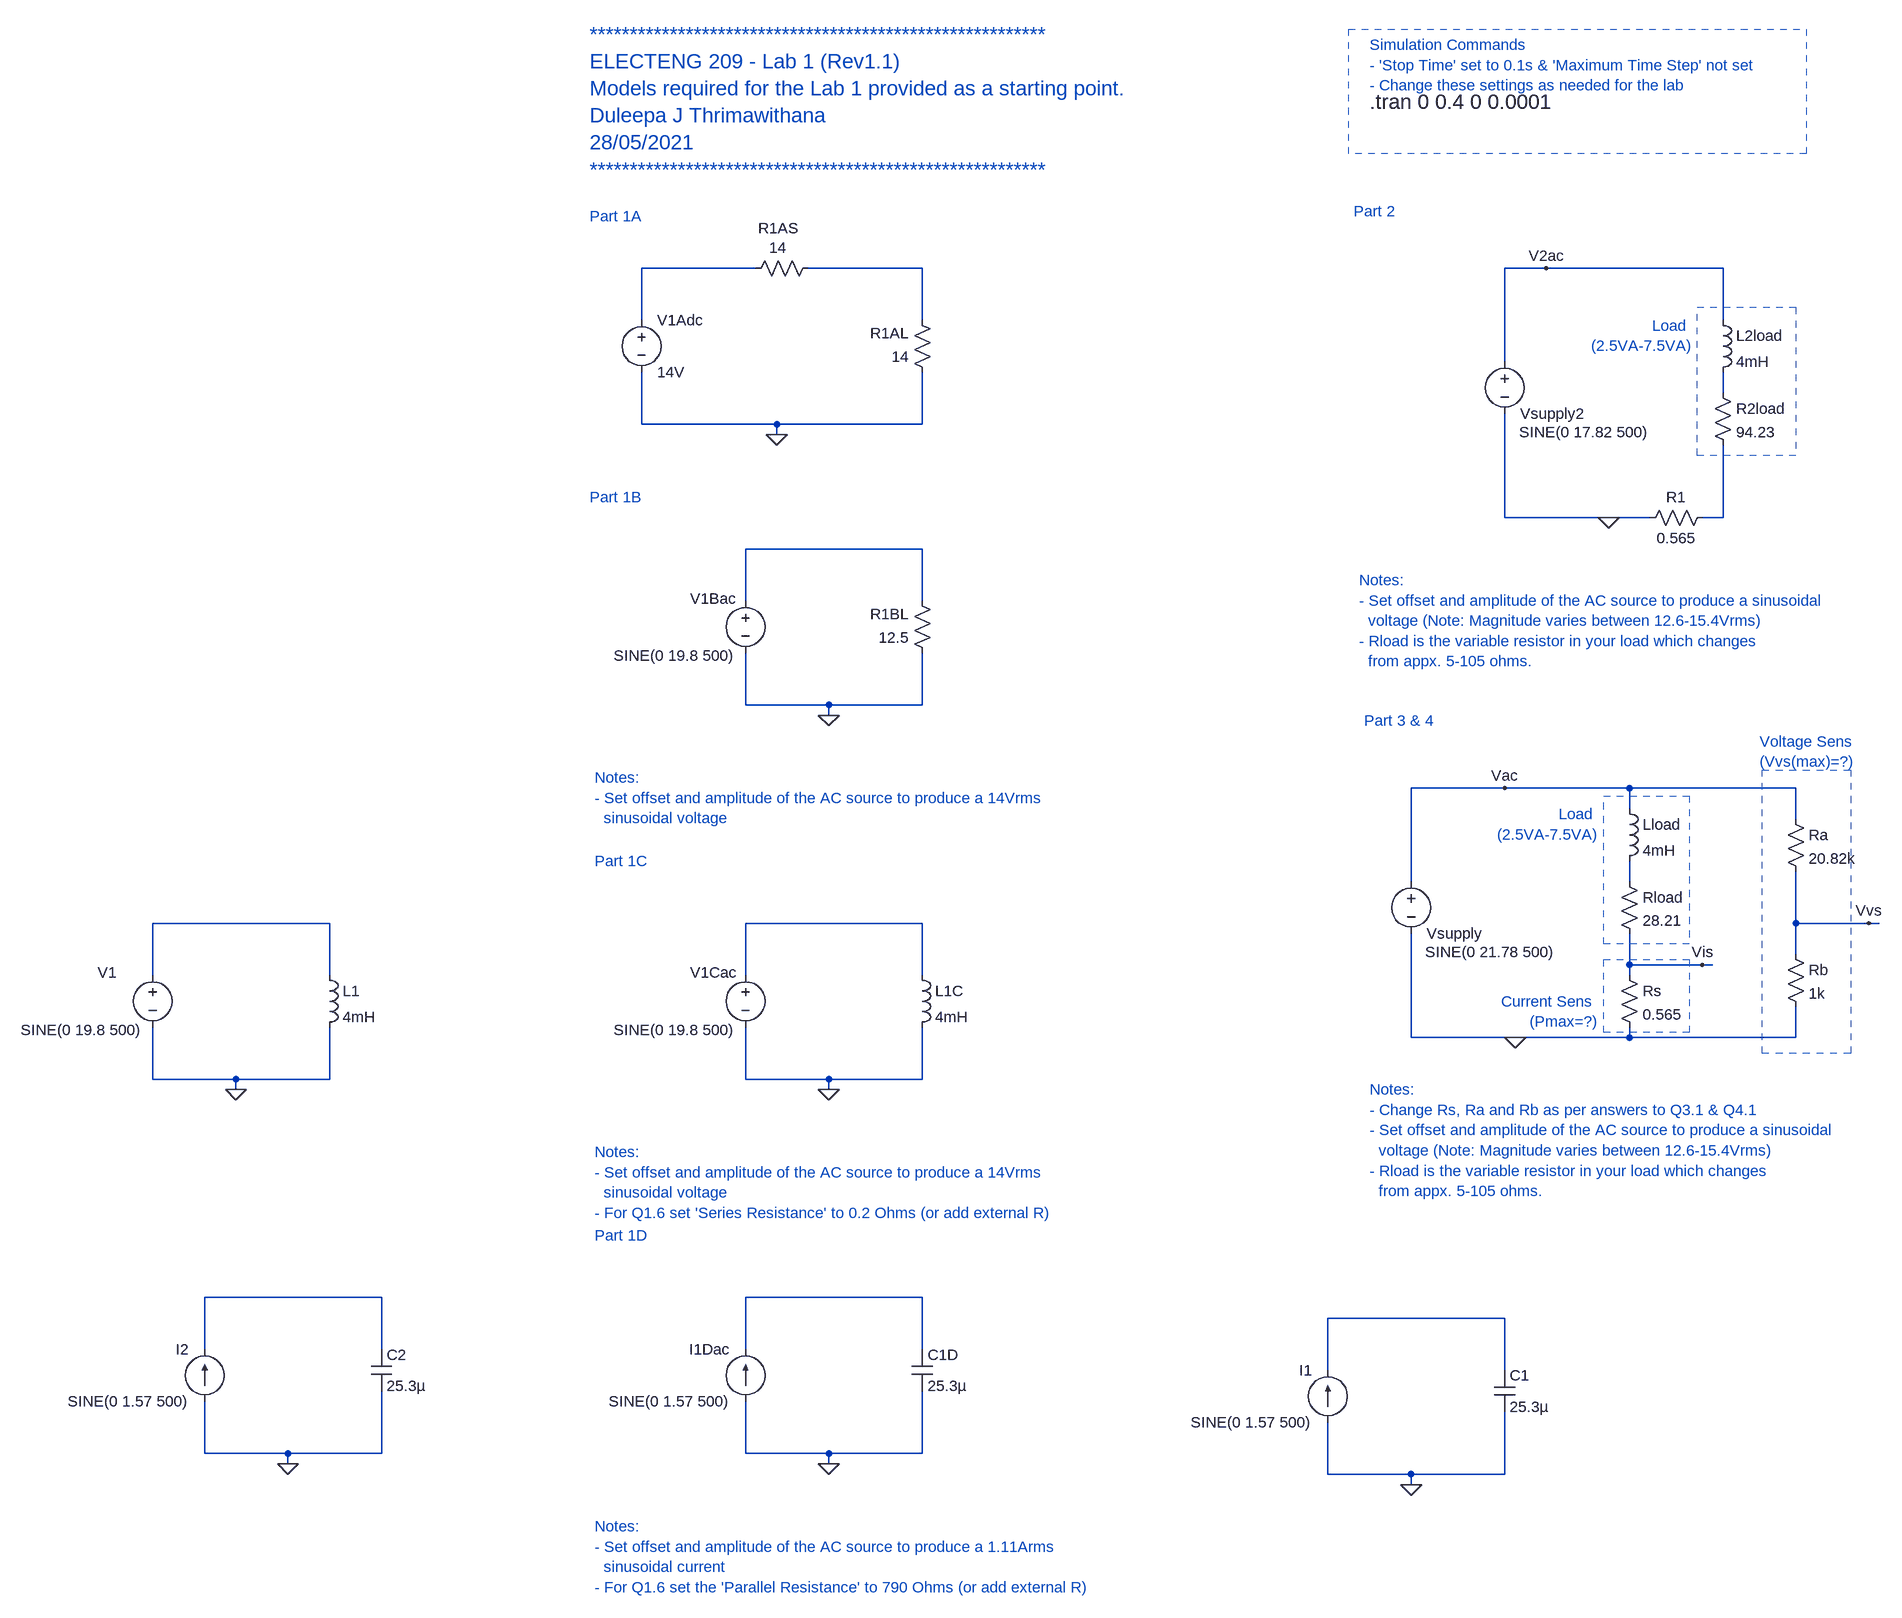
[diagram p0: schematic Lab1_Sensors_Q1.asc]
Lab1_Sensors_Q1.asc, the LTspice schematic file:
Version 4.1
SHEET 1 1984 2980
WIRE -528 144 -704 144
WIRE -272 144 -448 144
WIRE 688 144 624 144
WIRE 960 144 688 144
WIRE -704 224 -704 144
WIRE -272 224 -272 144
WIRE 960 224 960 144
WIRE 624 288 624 144
WIRE 960 336 960 304
WIRE -704 384 -704 304
WIRE -496 384 -704 384
WIRE -272 384 -272 304
WIRE -272 384 -496 384
WIRE -496 400 -496 384
WIRE 624 528 624 368
WIRE 784 528 624 528
WIRE 848 528 784 528
WIRE 960 528 960 416
WIRE 960 528 928 528
WIRE -272 576 -544 576
WIRE -544 656 -544 576
WIRE -272 656 -272 576
WIRE -544 816 -544 736
WIRE -416 816 -544 816
WIRE -272 816 -272 736
WIRE -272 816 -416 816
WIRE -416 832 -416 816
WIRE 624 944 480 944
WIRE 816 944 624 944
WIRE 1072 944 816 944
WIRE 816 976 816 944
WIRE 1072 992 1072 944
WIRE 480 1088 480 944
WIRE 816 1088 816 1056
WIRE -1184 1152 -1456 1152
WIRE -272 1152 -544 1152
WIRE 1072 1152 1072 1072
WIRE 1184 1152 1072 1152
WIRE 1200 1152 1184 1152
WIRE 1072 1200 1072 1152
WIRE 816 1216 816 1168
WIRE 928 1216 816 1216
WIRE 944 1216 928 1216
WIRE -1456 1232 -1456 1152
WIRE -1184 1232 -1184 1152
WIRE -544 1232 -544 1152
WIRE -272 1232 -272 1152
WIRE 816 1232 816 1216
WIRE 480 1328 480 1168
WIRE 640 1328 480 1328
WIRE 816 1328 816 1312
WIRE 816 1328 640 1328
WIRE 1072 1328 1072 1280
WIRE 1072 1328 816 1328
WIRE -1456 1392 -1456 1312
WIRE -1328 1392 -1456 1392
WIRE -1184 1392 -1184 1312
WIRE -1184 1392 -1328 1392
WIRE -544 1392 -544 1312
WIRE -416 1392 -544 1392
WIRE -272 1392 -272 1312
WIRE -272 1392 -416 1392
WIRE -1328 1408 -1328 1392
WIRE -416 1408 -416 1392
WIRE -1104 1728 -1376 1728
WIRE -272 1728 -544 1728
WIRE 624 1760 352 1760
WIRE -1376 1808 -1376 1728
WIRE -1104 1808 -1104 1728
WIRE -544 1808 -544 1728
WIRE -272 1808 -272 1728
WIRE 352 1840 352 1760
WIRE 624 1840 624 1760
WIRE -1376 1968 -1376 1888
WIRE -1248 1968 -1376 1968
WIRE -1104 1968 -1104 1872
WIRE -1104 1968 -1248 1968
WIRE -544 1968 -544 1888
WIRE -416 1968 -544 1968
WIRE -272 1968 -272 1872
WIRE -272 1968 -416 1968
WIRE -1248 1984 -1248 1968
WIRE -416 1984 -416 1968
WIRE 352 2000 352 1920
WIRE 480 2000 352 2000
WIRE 624 2000 624 1904
WIRE 624 2000 480 2000
WIRE 480 2016 480 2000
FLAG 784 528 0
FLAG 688 144 V2ac
FLAG -496 400 0
FLAG -416 832 0
FLAG -416 1408 0
FLAG -416 1984 0
FLAG 640 1328 0
FLAG 624 944 Vac
FLAG 928 1216 Vis
FLAG 1184 1152 Vvs
FLAG 480 2016 0
FLAG -1328 1408 0
FLAG -1248 1984 0
SYMBOL voltage 624 272 R0
WINDOW 0 24 96 Left 2
WINDOW 3 22 124 Left 2
WINDOW 123 0 0 Left 0
WINDOW 39 0 0 Left 0
SYMATTR InstName Vsupply2
SYMATTR Value SINE(0 17.82 500)
SYMBOL res 944 320 R0
SYMATTR InstName R2load
SYMATTR Value 94.23
SYMBOL ind 944 208 R0
SYMATTR InstName L2load
SYMATTR Value 4mH
SYMBOL voltage -704 208 R0
SYMATTR InstName V1Adc
SYMATTR Value 14V
SYMBOL res -432 128 R90
WINDOW 0 -30 61 VBottom 2
WINDOW 3 -31 62 VTop 2
SYMATTR InstName R1AS
SYMATTR Value 14
SYMBOL res -256 320 R180
WINDOW 0 36 76 Left 2
WINDOW 3 36 40 Left 2
SYMATTR InstName R1AL
SYMATTR Value 14
SYMBOL voltage -544 640 R0
WINDOW 0 -85 12 Left 2
WINDOW 3 -203 100 Left 2
WINDOW 123 0 0 Left 0
WINDOW 39 0 0 Left 0
SYMATTR InstName V1Bac
SYMATTR Value SINE(0 19.8 500)
SYMBOL res -256 752 R180
WINDOW 0 36 76 Left 2
WINDOW 3 36 40 Left 2
SYMATTR InstName R1BL
SYMATTR Value 12.5
SYMBOL voltage -544 1216 R0
WINDOW 0 -85 12 Left 2
WINDOW 3 -203 100 Left 2
WINDOW 123 0 0 Left 0
WINDOW 39 0 0 Left 0
SYMATTR InstName V1Cac
SYMATTR Value SINE(0 19.8 500)
SYMBOL ind -288 1216 R0
SYMATTR InstName L1C
SYMATTR Value 4mH
SYMATTR SpiceLine Rser=0.2
SYMBOL cap -288 1808 R0
SYMATTR InstName C1D
SYMATTR Value 25.3µ
SYMATTR SpiceLine Rpar=790
SYMBOL current -544 1888 R180
WINDOW 0 24 80 Left 2
WINDOW 3 24 0 Left 2
WINDOW 123 0 0 Left 0
WINDOW 39 0 0 Left 0
SYMATTR InstName I1Dac
SYMATTR Value SINE(0 1.57 500)
SYMBOL voltage 480 1072 R0
WINDOW 0 24 96 Left 2
WINDOW 3 22 124 Left 2
WINDOW 123 0 0 Left 0
WINDOW 39 0 0 Left 0
SYMATTR InstName Vsupply
SYMATTR Value SINE(0 21.78 500)
SYMBOL res 800 1072 R0
SYMATTR InstName Rload
SYMATTR Value 28.21
SYMBOL ind 800 960 R0
SYMATTR InstName Lload
SYMATTR Value 4mH
SYMBOL res 800 1216 R0
SYMATTR InstName Rs
SYMATTR Value 0.565
SYMBOL res 1056 976 R0
SYMATTR InstName Ra
SYMATTR Value 20.82k
SYMBOL res 1056 1184 R0
SYMATTR InstName Rb
SYMATTR Value 1k
SYMBOL cap 608 1840 R0
SYMATTR InstName C1
SYMATTR Value 25.3µ
SYMBOL current 352 1920 R180
WINDOW 0 24 80 Left 2
WINDOW 3 24 0 Left 2
WINDOW 123 0 0 Left 0
WINDOW 39 0 0 Left 0
SYMATTR InstName I1
SYMATTR Value SINE(0 1.57 500)
SYMBOL voltage -1456 1216 R0
WINDOW 0 -85 12 Left 2
WINDOW 3 -203 100 Left 2
WINDOW 123 0 0 Left 0
WINDOW 39 0 0 Left 0
SYMATTR InstName V1
SYMATTR Value SINE(0 19.8 500)
SYMBOL ind -1200 1216 R0
SYMATTR InstName L1
SYMATTR Value 4mH
SYMATTR SpiceLine Rser=0.2
SYMBOL cap -1120 1808 R0
SYMATTR InstName C2
SYMATTR Value 25.3µ
SYMATTR SpiceLine Rpar=790
SYMBOL current -1376 1888 R180
WINDOW 0 24 80 Left 2
WINDOW 3 24 0 Left 2
WINDOW 123 0 0 Left 0
WINDOW 39 0 0 Left 0
SYMATTR InstName I2
SYMATTR Value SINE(0 1.57 500)
SYMBOL res 944 512 R90
WINDOW 0 0 56 VBottom 2
WINDOW 3 32 56 VTop 2
SYMATTR InstName R1
SYMATTR Value 0.565
TEXT -784 64 Left 2 ;Part 1A
TEXT -784 496 Left 2 ;Part 1B
TEXT -784 -216 Left 3 ;*********************************************************\nELECTENG 209 - Lab 1 (Rev1.1)\nModels required for the Lab 1 provided as a starting point.\nDuleepa J Thrimawithana\n28/05/2021\n*********************************************************
TEXT 392 56 Left 2 ;Part 2
TEXT 400 624 Left 2 ;Notes: \n- Set offset and amplitude of the AC source to produce a sinusoidal\n  voltage (Note: Magnitude varies between 12.6-15.4Vrms)\n- Rload is the variable resistor in your load which changes \n  from appx. 5-105 ohms.
TEXT 912 232 Right 2 ;Load \n(2.5VA-7.5VA)
TEXT 416 -200 Left 2 ;Simulation Commands\n- 'Stop Time' set to 0.1s & 'Maximum Time Step' not set\n- Change these settings as needed for the lab
TEXT -776 1056 Left 2 ;Part 1C
TEXT -776 928 Left 2 ;Notes: \n- Set offset and amplitude of the AC source to produce a 14Vrms \n  sinusoidal voltage
TEXT 416 -112 Left 3 !.tran 0 0.4 0 0.0001
TEXT -776 1504 Left 2 ;Notes: \n- Set offset and amplitude of the AC source to produce a 14Vrms \n  sinusoidal voltage\n- For Q1.6 set 'Series Resistance' to 0.2 Ohms (or add external R)
TEXT -776 1632 Left 2 ;Part 1D
TEXT -776 2080 Left 2 ;Notes: \n- Set offset and amplitude of the AC source to produce a 1.11Arms \n  sinusoidal current\n- For Q1.6 set the 'Parallel Resistance' to 790 Ohms (or add external R)
TEXT 408 840 Left 2 ;Part 3 & 4
TEXT 416 1408 Left 2 ;Notes: \n- Change Rs, Ra and Rb as per answers to Q3.1 & Q4.1\n- Set offset and amplitude of the AC source to produce a sinusoidal\n  voltage (Note: Magnitude varies between 12.6-15.4Vrms)\n- Rload is the variable resistor in your load which changes \n  from appx. 5-105 ohms.
TEXT 768 984 Right 2 ;Load \n(2.5VA-7.5VA)
TEXT 768 1272 Right 2 ;Current Sens \n(Pmax=?)
TEXT 1016 872 Left 2 ;Voltage Sens\n(Vvs(max)=?)
RECTANGLE Normal 1020 916 1156 1352 2
RECTANGLE Normal 920 204 1072 432 2
RECTANGLE Normal 776 956 908 1184 2
RECTANGLE Normal 776 1208 908 1320 2
RECTANGLE Normal 1088 -32 384 -224 2

The netlist it stands for:
* Lab1_Sensors_Q1.asc
Vsupply2 V2ac 0 SINE(0 17.82 500)
R2load N003 N004 94.23
L2load V2ac N003 4mH
V1Adc N001 0 14V
R1AS N002 N001 14
R1AL 0 N002 14
V1Bac N005 0 SINE(0 19.8 500)
R1BL 0 N005 12.5
V1Cac N008 0 SINE(0 19.8 500)
L1C N008 0 4mH Rser=0.2
C1D N010 0 25.3µ Rpar=790
I1Dac 0 N010 SINE(0 1.57 500)
Vsupply Vac 0 SINE(0 21.78 500)
Rload N006 Vis 28.21
Lload Vac N006 4mH
Rs Vis 0 0.565
Ra Vac Vvs 20.82k
Rb Vvs 0 1k
C1 N011 0 25.3µ
I1 0 N011 SINE(0 1.57 500)
V1 N007 0 SINE(0 19.8 500)
L1 N007 0 4mH Rser=0.2
C2 N009 0 25.3µ Rpar=790
I2 0 N009 SINE(0 1.57 500)
R1 N004 0 0.565
* Part 1A
* Part 1B
* *********************************************************
* ELECTENG 209 - Lab 1 (Rev1.1)
* Models required for the Lab 1 provided as a starting point.
* Duleepa J Thrimawithana
* 28/05/2021
* *********************************************************
* Part 2
* Notes:
* - Set offset and amplitude of the AC source to produce a sinusoidal
*   voltage (Note: Magnitude varies between 12.6-15.4Vrms)
* - Rload is the variable resistor in your load which changes
*   from appx. 5-105 ohms.
* Load
* (2.5VA-7.5VA)
* Simulation Commands
* - 'Stop Time' set to 0.1s & 'Maximum Time Step' not set
* - Change these settings as needed for the lab
* Part 1C
* Notes:
* - Set offset and amplitude of the AC source to produce a 14Vrms
*   sinusoidal voltage
.tran 0 0.4 0 0.0001
* Notes:
* - Set offset and amplitude of the AC source to produce a 14Vrms
*   sinusoidal voltage
* - For Q1.6 set 'Series Resistance' to 0.2 Ohms (or add external R)
* Part 1D
* Notes:
* - Set offset and amplitude of the AC source to produce a 1.11Arms
*   sinusoidal current
* - For Q1.6 set the 'Parallel Resistance' to 790 Ohms (or add external R)
* Part 3 & 4
* Notes:
* - Change Rs, Ra and Rb as per answers to Q3.1 & Q4.1
* - Set offset and amplitude of the AC source to produce a sinusoidal
*   voltage (Note: Magnitude varies between 12.6-15.4Vrms)
* - Rload is the variable resistor in your load which changes
*   from appx. 5-105 ohms.
* Load
* (2.5VA-7.5VA)
* Current Sens
* (Pmax=?)
* Voltage Sens
* (Vvs(max)=?)
.backanno
.end